# Altium schematic sheet GAN_Synchronous_Buck.SchDoc
size A4; SheetNumber: 1; SheetTotal: 1
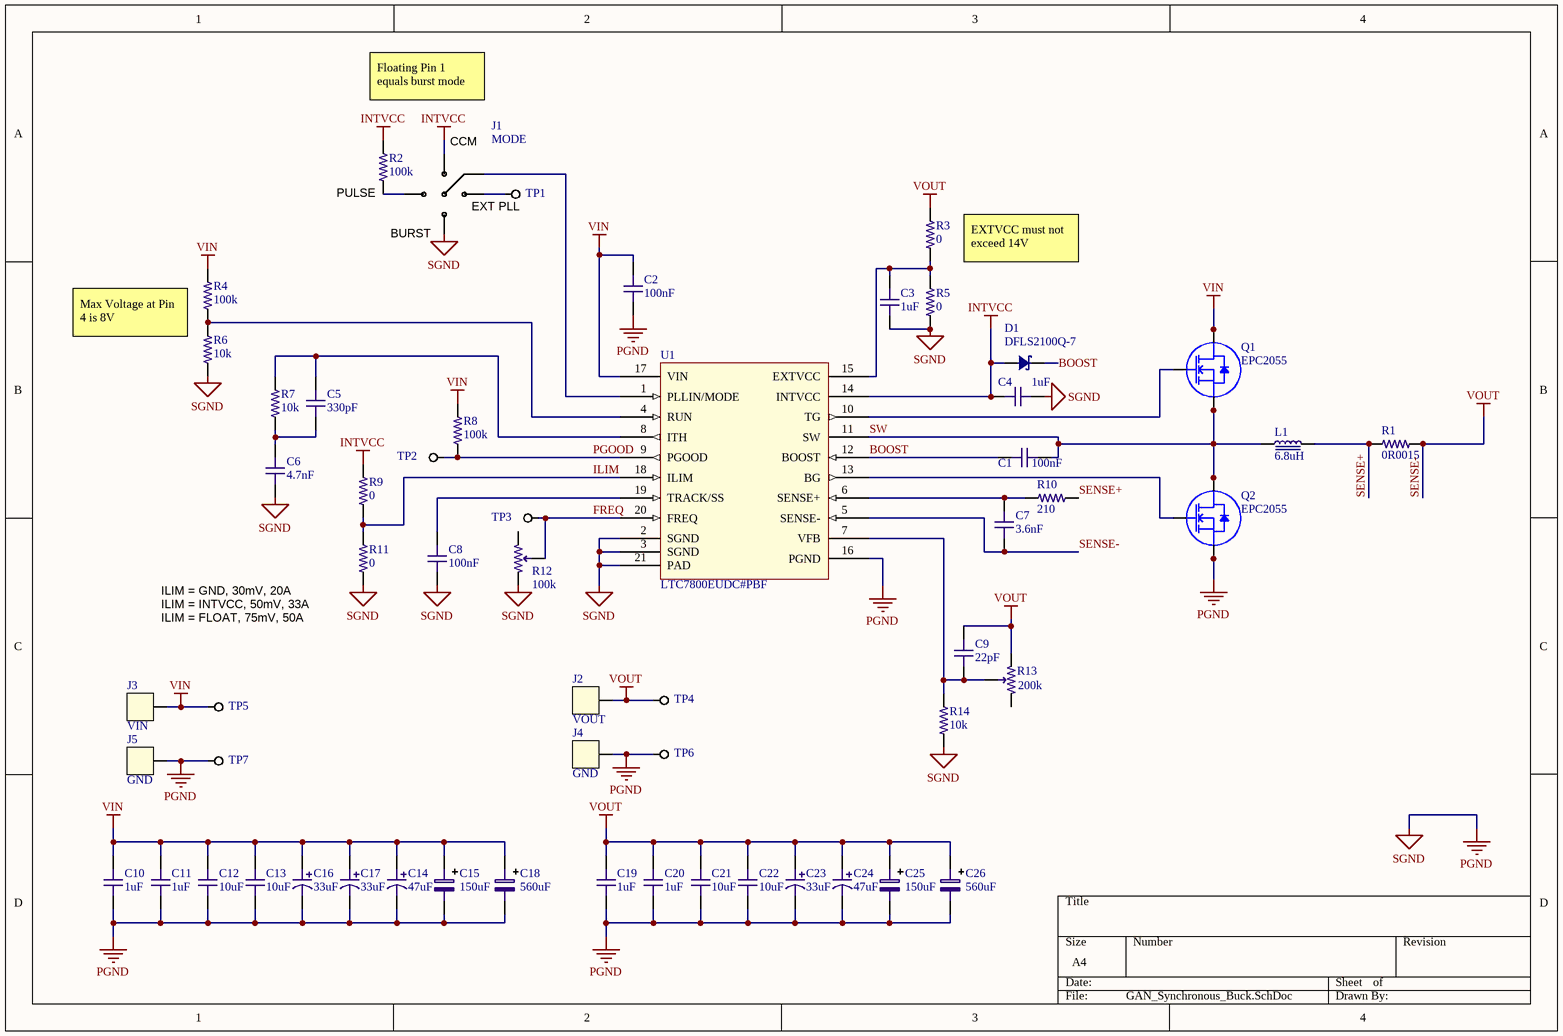
[diagram p0: GAN_Synchronous_Buck.SchDoc]

## Parts
C1  value 100nF  [C0603-IPC]  (hidden comment: C0603 100nF 50V X7R)
C2  value 100nF  [C0603-IPC]  (hidden comment: C0603 100nF 50V X7R)
C3  value 1uF  [C0603-IPC]  (hidden comment: C0603 1uF 50V X7R)
C4  value 1uF  [C0603-IPC]  (hidden comment: C0603 1uF 50V X7R)
C5  value 330pF  [C0603-IPC]  (hidden comment: C0603 330pF 50V C0G)
C6  value 4.7nF  [C0603-IPC]  (hidden comment: C0603 4.7nF 50V X7R)
C7  value 3.6nF  [C0603-IPC]  (hidden comment: C0603 3.6nF 50V C0G)
C8  value 100nF  [C0603-IPC]  (hidden comment: C0603 100nF 50V X7R)
C9  value 22pF  [C0603-IPC]  (hidden comment: C0603 22pF 50V C0G)
C10  value 1uF  [C0603-IPC]  (hidden comment: C0603 1uF 50V X7R)
C11  value 1uF  [C0603-IPC]  (hidden comment: C0603 1uF 50V X7R)
C12  value 10uF  [C1210-IPC]  (hidden comment: C1210 10uF 75V X5R)
C13  value 10uF  [C1210-IPC]  (hidden comment: C1210 10uF 75V X5R)
C14  value 47uF  [C-SMD-Polarized-6.3x7.7mm]  (hidden comment: UUR1H470MCL6GS)
C15  value 150uF  [C-POLARIZED-5-12.5]  (hidden comment: 35ZLH1000MEFC12.5X20)
C16  value 33uF  [C-SMD-Polarized-10x10.2mm]  (hidden comment: PCE3675CT-ND)
C17  value 33uF  [C-SMD-Polarized-10x10.2mm]  (hidden comment: PCE3675CT-ND)
C18  value 560uF  [C-POLARIZED-5-12.5]  (hidden comment: 35ZLH1000MEFC12.5X20)
C19  value 1uF  [C0603-IPC]  (hidden comment: C0603 1uF 50V X7R)
C20  value 1uF  [C0603-IPC]  (hidden comment: C0603 1uF 50V X7R)
C21  value 10uF  [C1210-IPC]  (hidden comment: C1210 10uF 75V X5R)
C22  value 10uF  [C1210-IPC]  (hidden comment: C1210 10uF 75V X5R)
C23  value 33uF  [C-SMD-Polarized-10x10.2mm]  (hidden comment: PCE3675CT-ND)
C24  value 47uF  [C-SMD-Polarized-6.3x7.7mm]  (hidden comment: UUR1H470MCL6GS)
C25  value 150uF  [C-POLARIZED-5-12.5]  (hidden comment: 35ZLH1000MEFC12.5X20)
C26  value 560uF  [C-POLARIZED-5-12.5]  (hidden comment: 35ZLH1000MEFC12.5X20)
D1  DFLS2100Q-7  [POWERDI 123]
J1  MODE  [4P Jumper]
J2  VOUT  [Banana Jack]
J3  VIN  [Banana Jack]
J4  GND  [Banana Jack]
J5  GND  [Banana Jack]
L1  value 6.8uH  [PQ2614BLA/BHA Bourns]  (hidden comment: PQ2614BLA-6R8K)
Q1  EPC2055  [D0133CT44M]
Q2  EPC2055  [D0133CT44M]
R1  value 0R0015  [R2512-IPC]  (hidden comment: ERJ-M1WTF1M5U)
R2  value 100k  [R0603-IPC]  (hidden comment: R0603 100K 1%)
R3  value 0  [R0603-IPC]  (hidden comment: R0603 0)
R4  value 100k  [R0603-IPC]  (hidden comment: R0603 100K 1%)
R5  value 0  [R0603-IPC]  (hidden comment: R0603 0)
R6  value 10k  [R0603-IPC-10K]  (hidden comment: R0603 10K 1%)
R7  value 10k  [R0603-IPC-10K]  (hidden comment: R0603 10K 1%)
R8  value 100k  [R0603-IPC]  (hidden comment: R0603 100K 1%)
R9  value 0  [R0603-IPC]  (hidden comment: R0603 0)
R10  value 210  [R0603-IPC]  (hidden comment: R0603 210R 1%)
R11  value 0  [R0603-IPC]  (hidden comment: R0603 0)
R12  value 100k  [POT4.8-3.5]  (hidden comment: FREQ)
R13  value 200k  [POT4.8-3.5]  (hidden comment: VOLTAGE)
R14  value 10k  [R0603-IPC-10K]  (hidden comment: R0603 10K 1%)
TP1  EXT_PLL  [Testpoint_TH]  (value not drawn)
TP2  PGOOD  [Testpoint_TH]  (value not drawn)
TP3  FREQ  [Testpoint_TH]  (value not drawn)
TP4  VOUT  [Testpoint_TH]  (value not drawn)
TP5  VIN  [Testpoint_TH]  (value not drawn)
TP6  GND  [Testpoint_TH]  (value not drawn)
TP7  GND  [Testpoint_TH]  (value not drawn)
U1  LTC7800EUDC#PBF  [QFN20 - 3x4MM - ADI]

## Nets
INTVCC: C4.1 D1.2 J1.1 R2.2 R9.2 U1.14(INTVCC)
PGND: C2.2 C3.1 C4.2 C6.1 C8.1 C10.1 C11.1 C12.1 C13.1 C14.2 C15.2 C16.2 C17.2 C18.2 C19.1 C20.1 C21.1 C22.1 C23.2 C24.2 C25.2 C26.2 J1.3 J4.1 J5.1 Q2.2(S) Q2.4(S) Q2.6(S) R5.1 R6.1 R11.1 R12.1 R14.1 TP6.1 TP7.1 U1.2(SGND) U1.3(SGND) U1.16(PGND) U1.21(PAD)  [also labelled SGND]
SENSE-: C7.1 C9.2 C19.2 C20.2 C21.2 C22.2 C23.1 C24.1 C25.1 C26.1 J2.1 R1.2 R3.2 R13.1 TP4.1 U1.5(SENSE-)  [also labelled VOUT]
VIN: C2.1 C10.2 C11.2 C12.2 C13.2 C14.1 C15.1 C16.1 C17.1 C18.1 J3.1 Q1.3(D) Q1.5(D) R4.2 R8.2 TP5.1 U1.17(VIN)
BOOST: C1.1 D1.1 U1.12(BOOST)
FREQ: R12.2(W) TP3.1 U1.20(FREQ)
ILIM: R9.1 R11.2 U1.18(ILIM)
PGOOD: R8.1 TP2.1 U1.9(PGOOD)
SENSE+: L1.2 R1.1 R10.1
SW: C1.2 L1.1 Q1.2(S) Q1.4(S) Q1.6(S) Q2.3(D) Q2.5(D) U1.11(SW)
NetC3_2: C3.2 R3.1 R5.2 U1.15(EXTVCC)
NetC5_1: C5.1 C6.2 R7.1
NetC5_2: C5.2 R7.2 U1.8(ITH)
NetC7_2: C7.2 R10.2 U1.6(SENSE+)
NetC8_2: C8.2 U1.19(TRACK/SS)
NetC9_1: C9.1 R13.2(W) R14.2 U1.7(VFB)
NetJ1_2: J1.2 TP1.1
NetJ1_4: J1.4 R2.1
NetJ1_5: J1.5 U1.1(PLLIN/MODE)
NetQ1_1: Q1.1(G) U1.10(TG)
NetQ2_1: Q2.1(G) U1.13(BG)
NetR4_1: R4.1 R6.2 U1.4(RUN)

Not connected (* = marked no-connect by the designer): R12 3; R13 3

## Notes on the sheet
- Floating Pin 1 equals burst mode
- (near J1) CCM
- (near R2) PULSE
- (near J1) BURST
- EXT PLL
- EXTVCC must not exceed 14V
- Max Voltage at Pin 4 is 8V
- ILIM = GND, 30mV, 20A
- ILIM = INTVCC, 50mV, 33A
- ILIM = FLOAT, 75mV, 50A

## Library data of the parts
C1 C2 C8 = C0603 100nF 50V X7R: CAP CER 0.1UF 50V X7R 0603; EIA Code: X7R; Max. Voltage: 50V; Features: Soft Termination; Ratings: AEC-Q200; Supplier 1: Digi-Key; Supplier Part Number 1: 490-5798-1-ND
C3 C4 C10 C11 C19 C20 = C0603 1uF 50V X7R: CAP CER 1UF 50V X7R 0603; EIA Code: X7R; Max. Voltage: 50V
C5 = C0603 330pF 50V C0G: CAP CER 330PF 50V C0G/NP0 0603; EIA Code: C0G; Max. Voltage: 50V
C6 = C0603 4.7nF 50V X7R: CAP CER 4700PF 50V X7R 0603; EIA Code: X7R; Max. Voltage: 50V; Supplier 1: Digi-Key; Supplier Part Number 1: 1276-2066-1-ND; Features: Soft Termination
C7 = C0603 3.6nF 50V C0G: Chip Capacitor, 0603, 3.6nF, 50V, X7R; EIA Code: C0G; Max. Voltage: 50V; Supplier 1: Digi-Key; Supplier Part Number 1: 490-6386-1-ND
C9 = C0603 22pF 50V C0G: CAP CER 22PF 50V C0G/NP0 0603; EIA Code: C0G; Max. Voltage: 50V; Supplier 1: Digi-Key; Supplier Part Number 1: 732-7795-1-ND
C12 C13 C21 C22 = C1210 10uF 16V X5R: Chip Capacitor, 1210, 10uF, 75V, X5R; EIA Code: X5R; Max. Voltage: 75V; Supplier 1: Digi-Key; Supplier Part Number 1: 587-1376-1-ND
C14 C24 = C-SMD 47uF 50V Electrolytic: 47uF ±20% 50V SMD,6.3x7.7mm Aluminum Electrolytic Capacitors - SMD; Supplier 1: Digi-Key; Supplier 2: Mouser; Supplier 3: LCSC; Supplier Part Number 1: 493-6230-1-ND; Supplier Part Number 2: 647-UUR1H470MCL6GS; Supplier Part Number 3: C445227
C15 C18 C25 C26 = C-THT 1000uF 35V Electrolytic: 1000uF ±20% 35V 12.5x20 10000Hrs @ 105℃ Radial,12.5x20mm Aluminum Electrolytic Capacitors - Leaded RoHS; Supplier 1: Digi-Key; Supplier 2: Mouser; Supplier 3: LCSC; Supplier Part Number 1: 1189-1888-ND; Supplier Part Number 2: 232-LH1000MEFC125X20; Supplier Part Number 3: C338194
C16 C17 C23 = C-SMD 33uF 80V Electrolytic: 33 µF 80 V Aluminum Electrolytic Capacitors Radial, Can - SMD 1Ohm @ 100kHz 2000 Hrs @ 125°C; Voltage: 80V; Supplier 1: Digi-Key; Supplier 2: Mouser; Supplier Part Number 1: PCE3675CT-ND; Supplier Part Number 2: 667-EEV-TG1K330P
D1 = DFLS1100-7: DIODE SCHOTTKY 100V POWERDI123; Current - Average Rectified (Io): 1A; Voltage - Forward (Vf) (Max) @ If: 770mV @ 1A; Current - Reverse Leakage @ Vr: 1µA @ 100V; Voltage - DC Reverse (Vr) (Max): 100V; Diode Type: Schottky; Supplier 1: Digi-Key; Supplier Part Number 1: DFLS1100DICT-ND
J1 = 4P Jumper: 0603 4 Way Solder Jumper
J2-J5 = Banana Jack: JACK NON-INSULATED .350"; Supplier 1: Digi-Key; Supplier Part Number 1: 36-575-8-ND
L1 = Bourns PQ2614BLA-6R8K: FIXED IND 6.8UH 30A 1.6 MOHM SMD; Saturation Current: 26A; Supplier 1: Digi-Key; Supplier 2: Mouser; Supplier Part Number 1: PQ2614BLA-6R8K-ND; Supplier Part Number 2: 652-PQ2614BLA-6R8K
Q1 Q2 = EPC2055: GANFET N-CH 40V 29A 3.6mOhm; MFG: EPC; QSGdescript: 40V 29A 3.6mE; MFGPN: EPC2055; Supplier 1: Digi-Key; SchDescript: 40V 29A 3.6mE; Supplier Part Number 1: 917-EPC2055CT-ND
R1 = R0805 0R0015 1%: RES SHUNT, 2512, 0.0015 OHM, 1%,; Supplier 1: Digi-Key; Supplier Part Number 1: P1.5NDCT-ND; Supplier 2: Mouser; Supplier Part Number 2: 667-ERJ-M1WTF1M5U
R2 R4 R8 = R0603 100K 1%: RES SMD 100K OHM 1% 1/10W 0603; Supplier 1: Digi-Key; Supplier Part Number 1: RMCF0603FT100KCT-ND
R3 R5 R9 R11 = R0603 0: RES SMD 0 OHM JUMPER 1/10W 0603; Supplier 1: Digi-Key; Supplier Part Number 1: RMCF0603ZT0R00CT-ND
R6 R7 R14 = R0603 10K 1%: RES SMD 10K OHM 1% 1/10W 0603; Supplier 1: Digi-Key; Supplier Part Number 1: RMCF0603FT10K0CT-ND
R10 = R0603 210R 1%: RES 210 OHM 1% 1/10W 0603; Supplier 1: Digi-Key; Supplier Part Number 1: RMCF0603FT210RCT-ND
R12 R13 = Trimmer 200k: 200 kOhms 0.25W, 1/4W J Lead Surface Mount Trimmer Potentiometer Cermet 5.0 Turn Side Adjustment; Supplier 1: Digi-Key; Supplier 2: Mouser; Supplier Part Number 1: 3214J-1-204ECT-ND; Supplier Part Number 2: 652-3214J-1-204E
TP1-TP7 = Testpoint_TH: Through-hole testpoint hook
U1 = LTC7800EUDC: Synchrnous Buck Regulator Positive Output Step-Down - DC-DC Controller IC 20-QFN (3x4); Supplier 1: Digi-Key; Supplier 2: Mouser; Supplier Part Number 1: LTC7800EUDC#PBF-ND; Supplier Part Number 2: 584-LTC7800EUDCPBF